# Altium project DAQ Board.PrjPcb
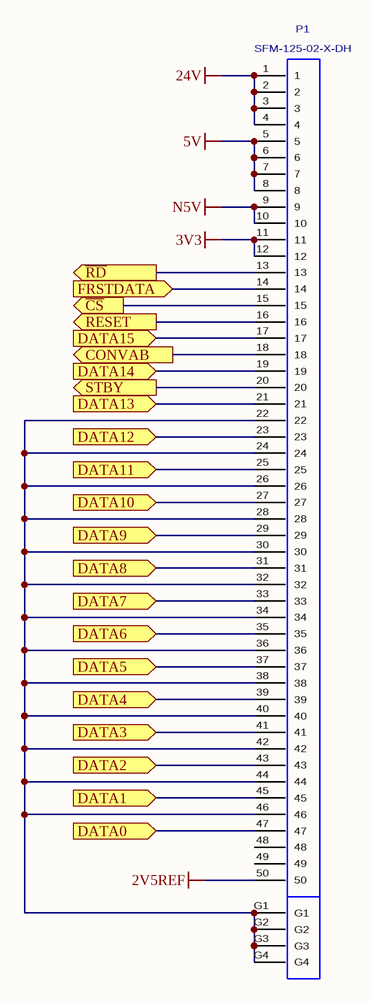
[diagram p0: DAQ Connector.SchDoc]
4 sheets, 86 parts. Net scope: flat (ports and power ports of the same name join across sheets).
Board file: DAQ_Board.PcbDoc
Sheets:
  DAQ Connector.SchDoc
  Charge Amp.SchDoc
  Analog to Digital Con.SchDoc
  Low Pass Filter.SchDoc

## Sheet DAQ Connector.SchDoc
size A

### Parts
P1  SFM-125-02-X-DH  [SFM-125-02-X-DH]

### Ports
CONVAB (out), DATA0 (in), DATA1 (in), DATA2 (in), DATA3 (in), DATA4 (in), DATA5 (in), DATA6 (in), DATA7 (in), DATA8 (in), DATA9 (in), DATA10 (in), DATA11 (in), DATA12 (in), DATA13 (in), DATA14 (in), DATA15 (in), FRSTDATA (in), RESET (out), STBY (out), ~{CS} (out), ~{RD} (out)

### Nets
2V5REF: P1.50
3V3: P1.11 P1.12
5V: P1.5 P1.6 P1.7 P1.8
24V: P1.1 P1.2 P1.3 P1.4
N5V: P1.9 P1.10
CONVAB: P1.18 ; port CONVAB
CS: P1.15 ; port ~{CS}
DATA0: P1.47 ; port DATA0
DATA1: P1.45 ; port DATA1
DATA2: P1.43 ; port DATA2
DATA3: P1.41 ; port DATA3
DATA4: P1.39 ; port DATA4
DATA5: P1.37 ; port DATA5
DATA6: P1.35 ; port DATA6
DATA7: P1.33 ; port DATA7
DATA8: P1.31 ; port DATA8
DATA9: P1.29 ; port DATA9
DATA10: P1.27 ; port DATA10
DATA11: P1.25 ; port DATA11
DATA12: P1.23 ; port DATA12
DATA13: P1.21 ; port DATA13
DATA14: P1.19 ; port DATA14
DATA15: P1.17 ; port DATA15
FRSTDATAA: P1.14 ; port FRSTDATA
RD: P1.13 ; port ~{RD}
RESET: P1.16 ; port RESET
STBY: P1.20 ; port STBY
NetP1_22: P1.22 P1.24 P1.26 P1.28 P1.30 P1.32 P1.34 P1.36 P1.38 P1.40 P1.42 P1.44 P1.46 P1.G1 P1.G2 P1.G3 P1.G4

Not connected (* = marked no-connect by the designer): P1 48 49

### Library data of the parts
P1 = SFM-125-02-X-DH: .050" (1,27mm) Tiger Eye Contact, Molded-to-Position Socket Strip, Double Horizontal.; MANUFACTURER: SAMTEC; CREATED: October 28, 2015 - Wendy Xin; PCB DECAL: SFM-125-02-X-DH

## Sheet Charge Amp.SchDoc
size A
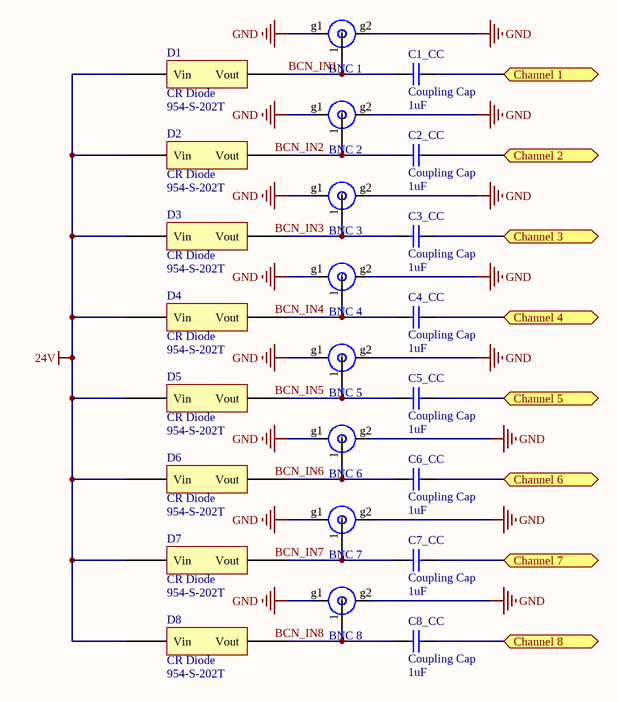
[diagram p1: Charge Amp.SchDoc]

### Parts
BNC_1  Component_1  [BNC 50OHM EDGE ACX2259]  (value not drawn)
BNC_2  Component_1  [BNC 50OHM EDGE ACX2259]  (value not drawn)
BNC_3  Component_1  [BNC 50OHM EDGE ACX2259]  (value not drawn)
BNC_4  Component_1  [BNC 50OHM EDGE ACX2259]  (value not drawn)
BNC_5  Component_1  [BNC 50OHM EDGE ACX2259]  (value not drawn)
BNC_6  Component_1  [BNC 50OHM EDGE ACX2259]  (value not drawn)
BNC_7  Component_1  [BNC 50OHM EDGE ACX2259]  (value not drawn)
BNC_8  Component_1  [BNC 50OHM EDGE ACX2259]  (value not drawn)
C1_CC  Coupling Cap  value 1uF  [6-0805_N]
C2_CC  Coupling Cap  value 1uF  [6-0805_N]
C3_CC  Coupling Cap  value 1uF  [6-0805_N]
C4_CC  Coupling Cap  value 1uF  [6-0805_N]
C5_CC  Coupling Cap  value 1uF  [6-0805_N]
C6_CC  Coupling Cap  value 1uF  [6-0805_N]
C7_CC  Coupling Cap  value 1uF  [6-0805_N]
C8_CC  Coupling Cap  value 1uF  [6-0805_N]
D1  CR Diode  Supplier Part Number 1: 954-S-202T  [CR Diode - duplicate1]
D2  CR Diode  Supplier Part Number 1: 954-S-202T  [CR Diode - duplicate1]
D3  CR Diode  Supplier Part Number 1: 954-S-202T  [CR Diode - duplicate1]
D4  CR Diode  Supplier Part Number 1: 954-S-202T  [CR Diode - duplicate1]
D5  CR Diode  Supplier Part Number 1: 954-S-202T  [CR Diode - duplicate1]
D6  CR Diode  Supplier Part Number 1: 954-S-202T  [CR Diode - duplicate1]
D7  CR Diode  Supplier Part Number 1: 954-S-202T  [CR Diode - duplicate1]
D8  CR Diode  Supplier Part Number 1: 954-S-202T  [CR Diode - duplicate1]

### Ports
Channel 1, Channel 2, Channel 3, Channel 4, Channel 5, Channel 6, Channel 7, Channel 8

### Nets
24V: D1.a(Vin) D2.a(Vin) D3.a(Vin) D4.a(Vin) D5.a(Vin) D6.a(Vin) D7.a(Vin) D8.a(Vin)
GND: BNC_1.g1 BNC_1.g2(0) BNC_2.g1 BNC_2.g2(0) BNC_3.g1 BNC_3.g2(0) BNC_4.g1 BNC_4.g2(0) BNC_5.g1 BNC_5.g2(0) BNC_6.g1 BNC_6.g2(0) BNC_7.g1 BNC_7.g2(0) BNC_8.g1 BNC_8.g2(0)
BCN_IN1: BNC_1.1(Signal) C1_CC.1 D1.k(Vout)
NetBNC_2_1: BNC_2.1(Signal) C2_CC.1 D2.k(Vout)
NetBNC_3_1: BNC_3.1(Signal) C3_CC.1 D3.k(Vout)
NetBNC_4_1: BNC_4.1(Signal) C4_CC.1 D4.k(Vout)
NetBNC_5_1: BNC_5.1(Signal) C5_CC.1 D5.k(Vout)
NetBNC_6_1: BNC_6.1(Signal) C6_CC.1 D6.k(Vout)
NetBNC_7_1: BNC_7.1(Signal) C7_CC.1 D7.k(Vout)
NetBNC_8_1: BNC_8.1(Signal) C8_CC.1 D8.k(Vout)
NetC1_CC_2: C1_CC.2 ; port Channel 1
NetC2_CC_2: C2_CC.2 ; port Channel 2
NetC3_CC_2: C3_CC.2 ; port Channel 3
NetC4_CC_2: C4_CC.2 ; port Channel 4
NetC5_CC_2: C5_CC.2 ; port Channel 5
NetC6_CC_2: C6_CC.2 ; port Channel 6
NetC7_CC_2: C7_CC.2 ; port Channel 7
NetC8_CC_2: C8_CC.2 ; port Channel 8

### Notes on the sheet
- Labels drawn without touching a wire or pin: BCN_IN2, BCN_IN3, BCN_IN4, BCN_IN5, BCN_IN6, BCN_IN7, BCN_IN8

### Library data of the parts
BNC_1-BNC_8 = Component_1: CONN BNC JACK 50 OHM EDGE MNT; Supplier 1: Digi-Key; Supplier Part Number 1: ACX2259-ND
C1_CC C2_CC C3_CC C4_CC C5_CC C6_CC C7_CC C8_CC = Cap Semi: Capacitor (Semiconductor SIM Model); Published: 8-Jun-2000; LatestRevisionDate: 29-May-2009; LatestRevisionNote: IPC-7351 Footprint Added.; PackageReference: C1206; Publisher: Altium Limited; PackageDescription: Chip Capacitor; Supplier 1: Digi-Key; Supplier Part Number 1: 1276-1066-1-ND
D1-D8 = Diode_1: Current Regulator Diodes 100V 2mA; Supplier 1: Mouser

## Sheet Analog to Digital Con.SchDoc
size A
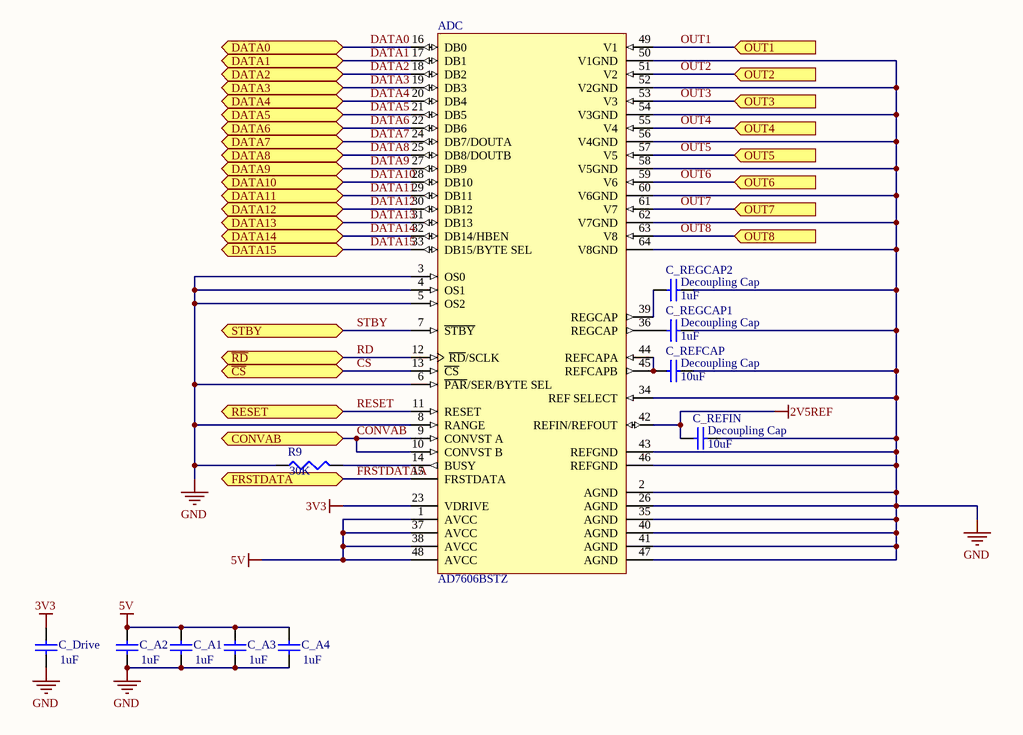
[diagram p2: Analog to Digital Con.SchDoc]

### Parts
ADC  AD7606BSTZ  [ST-64-2_N]
C_A1  value 1uF  [6-0805_N]  (hidden comment: Decoupling Cap)
C_A2  value 1uF  [6-0805_N]  (hidden comment: Decoupling Cap)
C_A3  value 1uF  [6-0805_N]  (hidden comment: Decoupling Cap)
C_A4  value 1uF  [6-0805_N]  (hidden comment: Decoupling Cap)
C_Drive  value 1uF  [6-0805_N]  (hidden comment: Decoupling Cap)
C_REFCAP  Decoupling Cap  value 10uF  [6-0805_N]
C_REFIN  Decoupling Cap  value 10uF  [6-0805_N]
C_REGCAP1  Decoupling Cap  value 1uF  [6-0805_N]
C_REGCAP2  Decoupling Cap  value 1uF  [6-0805_N]
R9  value 30K  [6-0805_N]  (hidden comment: Res3)

### Ports
CONVAB, DATA0, DATA1, DATA2, DATA3, DATA4, DATA5, DATA6, DATA7, DATA8, DATA9, DATA10, DATA11, DATA12, DATA13, DATA14, DATA15, FRSTDATA, OUT1 (in), OUT2 (in), OUT3 (in), OUT4 (in), OUT5 (in), OUT6 (in), OUT7 (in), OUT8 (in), RESET, STBY, ~{CS}, ~{RD}

### Nets
2V5REF: ADC.42(REFIN/REFOUT) C_REFIN.2
3V3: ADC.23(VDRIVE) C_Drive.1
5V: ADC.1(AVCC) ADC.37(AVCC) ADC.38(AVCC) ADC.48(AVCC) C_A1.1 C_A2.1 C_A3.1 C_A4.1
GND: ADC.2(AGND) ADC.3(OS0) ADC.4(OS1) ADC.5(OS2) ADC.6(~{PAR}/SER/BYTE_SEL) ADC.8(RANGE) ADC.26(AGND) ADC.34(REF_SELECT) ADC.35(AGND) ADC.40(AGND) ADC.41(AGND) ADC.43(REFGND) ADC.46(REFGND) ADC.47(AGND) ADC.50(V1GND) ADC.52(V2GND) ADC.54(V3GND) ADC.56(V4GND) ADC.58(V5GND) ADC.60(V6GND) ADC.62(V7GND) ADC.64(V8GND) C_A1.2 C_A2.2 C_A3.2 C_A4.2 C_Drive.2 C_REFCAP.1 C_REFIN.1 C_REGCAP1.1 C_REGCAP2.1 R9.1
CONVAB: ADC.9(CONVST_A) ADC.10(CONVST_B) ; port CONVAB
CS: ADC.13(~{CS}) ; port ~{CS}
DATA0: ADC.16(DB0) ; port DATA0
DATA1: ADC.17(DB1) ; port DATA1
DATA2: ADC.18(DB2) ; port DATA2
DATA3: ADC.19(DB3) ; port DATA3
DATA4: ADC.20(DB4) ; port DATA4
DATA5: ADC.21(DB5) ; port DATA5
DATA6: ADC.22(DB6) ; port DATA6
DATA7: ADC.24(DB7/DOUTA) ; port DATA7
DATA8: ADC.25(DB8/DOUTB) ; port DATA8
DATA9: ADC.27(DB9) ; port DATA9
DATA10: ADC.28(DB10) ; port DATA10
DATA11: ADC.29(DB11) ; port DATA11
DATA12: ADC.30(DB12) ; port DATA12
DATA13: ADC.31(DB13) ; port DATA13
DATA14: ADC.32(DB14/HBEN) ; port DATA14
DATA15: ADC.33(DB15/BYTE_SEL) ; port DATA15
FRSTDATAA: ADC.15(FRSTDATA) ; port FRSTDATA
OUT1: ADC.49(V1) ; port OUT1
OUT2: ADC.51(V2) ; port OUT2
OUT3: ADC.53(V3) ; port OUT3
OUT4: ADC.55(V4) ; port OUT4
OUT5: ADC.57(V5) ; port OUT5
OUT6: ADC.59(V6) ; port OUT6
OUT7: ADC.61(V7) ; port OUT7
OUT8: ADC.63(V8) ; port OUT8
RD: ADC.12(~{RD}/SCLK) ; port ~{RD}
RESET: ADC.11(RESET) ; port RESET
STBY: ADC.7(~{STBY}) ; port STBY
NetADC_14: ADC.14(BUSY) R9.2
NetADC_36: ADC.36(REGCAP) C_REGCAP1.2
NetADC_39: ADC.39(REGCAP) C_REGCAP2.2
NetADC_44: ADC.44(REFCAPA) ADC.45(REFCAPB) C_REFCAP.2

### Library data of the parts
ADC = AD7606BSTZ: 8 Channel Data Acquisition System with 16-Bit, Bipolar Input, Simultaneous Sampling Analog-to-Digital Converter with Parallel, Serial and SPI Interface, 200KSPS, -40 to +85 degC, ST-64-2, Pb-Free, Tray; Generic Part Number: AD7606; Manufacturer: Analog Devices; Resolution (Bits): 16; Channels: 8; Throughput Rate (SPS): 200K; Interface: Par, Ser, SPI; DatasheetVersion: Rev.C; PackageVersion: 051706-A; PackageReference: ST-64-2; PackageDescription: 64-Lead Low Profile Quad Flat Package [LQFP]; Supplier 1: Digi-Key; Supplier Part Number 1: AD7606BSTZ-ND; Supplier 2: Farnell; Supplier Part Number 2: 1864685; Supplier 3: Newark; Supplier Part Number 3: 76R7614; Supplier 4: Mouser; Supplier Part Number 4: 584-AD7606BSTZ; RoHS: Y; Packing: Tray; Mounting Technology: Surface Mount; Code_JEDEC: MS-026-BCD; PartNumber: AD7606BSTZ; ComponentLink1Description: Manufacturer URL; ComponentLink1URL: http://www.analog.com/en/index.html; ComponentLink2Description: Datasheet; ComponentLink2URL: http://www.analog.com/static/imported-files/data_sheets/AD7606_7606-6_7606-4.pdf; ComponentLink3Description: Package Specification; ComponentLink3URL: http://www.analog.com/static/imported-files/packages/PKG_PDF/LQFP%28ST%29/ST_64_2.pdf; ComponentLink4Description: Product URL; ComponentLink4URL: http://www.analog.com/en/analog-to-digital-converters/ad-converters/ad7606/products/product.html
C_A1-C_A4 C_Drive C_REFCAP C_REFIN C_REGCAP1 C_REGCAP2 = Cap Semi: Capacitor (Semiconductor SIM Model); Published: 8-Jun-2000; LatestRevisionDate: 29-May-2009; LatestRevisionNote: IPC-7351 Footprint Added.; PackageReference: C1206; Publisher: Altium Limited; PackageDescription: Chip Capacitor; Supplier 2: Digi-Key
  C_A1-C_A4 C_Drive C_REGCAP1 C_REGCAP2: Supplier Part Number 2: 1276-1066-1-ND
  C_REFCAP C_REFIN: Supplier Part Number 2: 490-3340-1-ND
R9 = Res3: Resistor; Published: 8-Jun-2000; LatestRevisionDate: 29-May-2009; LatestRevisionNote: IPC-7351 Footprint Added.; PackageReference: J1-0603; Publisher: Altium Limited; PackageDescription: Chip Resistor; Supplier 1: Digi-Key; Supplier Part Number 1: 311-30KARCT-ND

## Sheet Low Pass Filter.SchDoc
size A
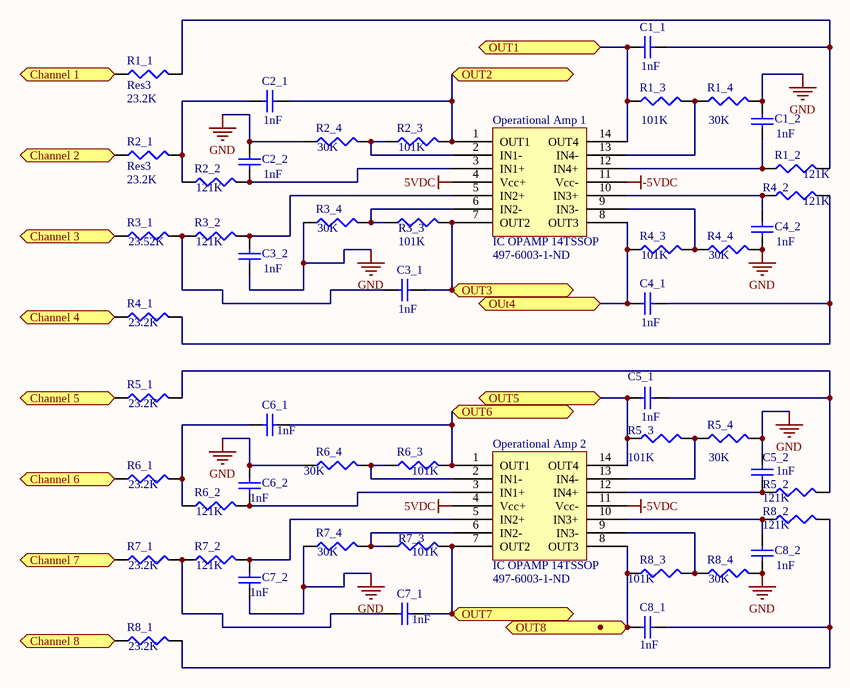
[diagram p3: Low Pass Filter.SchDoc]

### Parts
C1_1  value 1nF  [6-0805_N]  (hidden comment: Cap Semi)
C1_2  value 1nF  [6-0805_N]  (hidden comment: Cap Semi)
C2_1  value 1nF  [6-0805_N]  (hidden comment: Cap Semi)
C2_2  value 1nF  [6-0805_N]  (hidden comment: Cap Semi)
C3_1  value 1nF  [6-0805_N]  (hidden comment: Cap Semi)
C3_2  value 1nF  [6-0805_N]  (hidden comment: Cap Semi)
C4_1  value 1nF  [6-0805_N]  (hidden comment: Cap Semi)
C4_2  value 1nF  [6-0805_N]  (hidden comment: Cap Semi)
C5_1  value 1nF  [6-0805_N]  (hidden comment: Cap Semi)
C5_2  value 1nF  [6-0805_N]  (hidden comment: Cap Semi)
C6_1  value 1nF  [6-0805_N]  (hidden comment: Cap Semi)
C6_2  value 1nF  [6-0805_N]  (hidden comment: Cap Semi)
C7_1  value 1nF  [6-0805_N]  (hidden comment: Cap Semi)
C7_2  value 1nF  [6-0805_N]  (hidden comment: Cap Semi)
C8_1  value 1nF  [6-0805_N]  (hidden comment: Cap Semi)
C8_2  value 1nF  [6-0805_N]  (hidden comment: Cap Semi)
Operational_Amp_1  IC OPAMP 14TSSOP  Supplier Part Number 1: 497-6003-1-ND  [TSV994IPT]
Operational_Amp_2  IC OPAMP 14TSSOP  Supplier Part Number 1: 497-6003-1-ND  [TSV994IPT]
R1_1  Res3  value 23.2K  [6-0805_N]
R1_2  value 121K  [6-0805_N]  (hidden comment: Res3)
R1_3  value 101K  [6-0805_N]  (hidden comment: Res3)
R1_4  value 30K  [6-0805_N]  (hidden comment: Res3)
R2_1  Res3  value 23.2K  [6-0805_N]
R2_2  value 121K  [6-0805_N]  (hidden comment: Res3)
R2_3  value 101K  [6-0805_N]  (hidden comment: Res3)
R2_4  value 30K  [6-0805_N]  (hidden comment: Res3)
R3_1  value 23.52K  [6-0805_N]  (hidden comment: Res3)
R3_2  value 121K  [6-0805_N]  (hidden comment: Res3)
R3_3  value 101K  [6-0805_N]  (hidden comment: Res3)
R3_4  value 30K  [6-0805_N]  (hidden comment: Res3)
R4_1  value 23.2K  [6-0805_N]  (hidden comment: Res3)
R4_2  value 121K  [6-0805_N]  (hidden comment: Res3)
R4_3  value 101K  [6-0805_N]  (hidden comment: Res3)
R4_4  value 30K  [6-0805_N]  (hidden comment: Res3)
R5_1  value 23.2K  [6-0805_N]  (hidden comment: Res3)
R5_2  value 121K  [6-0805_N]  (hidden comment: Res3)
R5_3  value 101K  [6-0805_N]  (hidden comment: Res3)
R5_4  value 30K  [6-0805_N]  (hidden comment: Res3)
R6_1  value 23.2K  [6-0805_N]  (hidden comment: Res3)
R6_2  value 121K  [6-0805_N]  (hidden comment: Res3)
R6_3  value 101K  [6-0805_N]  (hidden comment: Res3)
R6_4  value 30K  [6-0805_N]  (hidden comment: Res3)
R7_1  value 23.2K  [6-0805_N]  (hidden comment: Res3)
R7_2  value 121K  [6-0805_N]  (hidden comment: Res3)
R7_3  value 101K  [6-0805_N]  (hidden comment: Res3)
R7_4  value 30K  [6-0805_N]  (hidden comment: Res3)
R8_1  value 23.2K  [6-0805_N]  (hidden comment: Res3)
R8_2  value 121K  [6-0805_N]  (hidden comment: Res3)
R8_3  value 101K  [6-0805_N]  (hidden comment: Res3)
R8_4  value 30K  [6-0805_N]  (hidden comment: Res3)

### Ports
Channel 1, Channel 2, Channel 3, Channel 4, Channel 5, Channel 6, Channel 7, Channel 8, OUT1, OUT2, OUT3, OUt4, OUT5, OUT6, OUT7, OUT8

### Nets
5VDC: Operational_Amp_1.4(Vcc+) Operational_Amp_2.4(Vcc+)
-5VDC: Operational_Amp_1.11(Vcc-) Operational_Amp_2.11(Vcc-)
GND: C1_2.1 C2_2.2 C3_2.1 C4_2.1 C5_2.2 C6_2.2 C7_2.1 C8_2.1 R1_4.2 R2_4.1 R3_4.1 R4_4.2 R5_4.2 R6_4.1 R7_4.1 R8_4.2
OUT1: C1_1.1 Operational_Amp_1.14(OUT4) R1_3.1 ; port OUT1
OUT2: C2_1.2 Operational_Amp_1.1(OUT1) R2_3.2 ; port OUT2
OUT3: C3_1.2 Operational_Amp_1.7(OUT2) R3_3.2 ; port OUT3
OUT4: C4_1.1 Operational_Amp_1.8(OUT3) R4_3.1 ; port OUt4
OUT5: C5_1.1 Operational_Amp_2.14(OUT4) R5_3.1 ; port OUT5
OUT6: C6_1.2 Operational_Amp_2.1(OUT1) R6_3.2 ; port OUT6
OUT7: C7_1.2 Operational_Amp_2.7(OUT2) R7_3.2 ; port OUT7
OUT8: C8_1.2 Operational_Amp_2.8(OUT3) R8_3.1 ; port OUT8
NetC1_1_2: C1_1.2 R1_1.2 R1_2.2
NetC1_2_2: C1_2.2 Operational_Amp_1.12(IN4+) R1_2.1
NetC1_CC_2: R1_1.1 ; port Channel 1
NetC2_1_1: C2_1.1 R2_1.2 R2_2.1
NetC2_2_1: C2_2.1 Operational_Amp_1.3(IN1+) R2_2.2
NetC2_CC_2: R2_1.1 ; port Channel 2
NetC3_1_1: C3_1.1 R3_1.2 R3_2.1
NetC3_2_2: C3_2.2 Operational_Amp_1.5(IN2+) R3_2.2
NetC3_CC_2: R3_1.1 ; port Channel 3
NetC4_1_2: C4_1.2 R4_1.2 R4_2.2
NetC4_2_2: C4_2.2 Operational_Amp_1.10(IN3+) R4_2.1
NetC4_CC_2: R4_1.1 ; port Channel 4
NetC5_1_2: C5_1.2 R5_1.2 R5_2.2
NetC5_2_1: C5_2.1 Operational_Amp_2.12(IN4+) R5_2.1
NetC5_CC_2: R5_1.1 ; port Channel 5
NetC6_1_1: C6_1.1 R6_1.2 R6_2.1
NetC6_2_1: C6_2.1 Operational_Amp_2.3(IN1+) R6_2.2
NetC6_CC_2: R6_1.1 ; port Channel 6
NetC7_1_1: C7_1.1 R7_1.2 R7_2.1
NetC7_2_2: C7_2.2 Operational_Amp_2.5(IN2+) R7_2.2
NetC7_CC_2: R7_1.1 ; port Channel 7
NetC8_1_1: C8_1.1 R8_1.2 R8_2.2
NetC8_2_2: C8_2.2 Operational_Amp_2.10(IN3+) R8_2.1
NetC8_CC_2: R8_1.1 ; port Channel 8
NetOperational_Amp_1_2: Operational_Amp_1.2(IN1-) R2_3.1 R2_4.2
NetOperational_Amp_1_6: Operational_Amp_1.6(IN2-) R3_3.1 R3_4.2
NetOperational_Amp_1_9: Operational_Amp_1.9(IN3-) R4_3.2 R4_4.1
NetOperational_Amp_1_13: Operational_Amp_1.13(IN4-) R1_3.2 R1_4.1
NetOperational_Amp_2_2: Operational_Amp_2.2(IN1-) R6_3.1 R6_4.2
NetOperational_Amp_2_6: Operational_Amp_2.6(IN2-) R7_3.1 R7_4.2
NetOperational_Amp_2_9: Operational_Amp_2.9(IN3-) R8_3.2 R8_4.1
NetOperational_Amp_2_13: Operational_Amp_2.13(IN4-) R5_3.2 R5_4.1

### Library data of the parts
C1_1 C1_2 C2_1 C2_2 C3_1 C3_2 C4_1 C4_2 C5_1 C5_2 C6_1 C6_2 C7_1 C7_2 C8_1 C8_2 = Cap Semi: Capacitor (Semiconductor SIM Model); Published: 8-Jun-2000; LatestRevisionDate: 29-May-2009; LatestRevisionNote: IPC-7351 Footprint Added.; PackageReference: C1206; Publisher: Altium Limited; PackageDescription: Chip Capacitor
  C1_1 C1_2 C2_1 C2_2 C3_1 C4_1 C4_2 C5_1 C5_2 C6_1 C6_2 C7_1 C7_2 C8_1 C8_2: Supplier 2: Digi-Key; Supplier Part Number 2: 1276-1066-1-ND
  C3_2: Supplier 1: Digi-Key; Supplier Part Number 1: 1276-1066-1-ND
Operational_Amp_1 Operational_Amp_2 = Component_1: Supplier 1: Digi-Key
R1_1-R1_4 R2_1-R2_4 R3_1-R3_4 R4_1-R4_4 R5_1-R5_4 R6_1-R6_4 R7_1-R7_4 R8_1-R8_4 = Res3: Resistor; Published: 8-Jun-2000; LatestRevisionDate: 29-May-2009; LatestRevisionNote: IPC-7351 Footprint Added.; PackageReference: J1-0603; Publisher: Altium Limited; PackageDescription: Chip Resistor
  R1_1 R2_1 R3_1 R4_1 R5_1 R6_1 R7_1 R8_1: Supplier 2: Digi-Key; Supplier Part Number 2: 311-23.2KCRCT-ND
  R1_2 R2_2 R3_2 R4_2 R5_2 R6_2 R7_2 R8_2: Supplier 1: Digi-Key; Supplier Part Number 1: 311-121KCRCT-ND
  R1_3 R4_3 R5_3 R6_3 R7_3: Supplier 2: Digi-Key; Supplier Part Number 2: RNCF0805BTC101K-ND
  R1_4 R2_4 R3_4 R4_4 R5_4 R6_4 R7_4 R8_4: Supplier 1: Digi-Key; Supplier Part Number 1: 311-30KARCT-ND
  R2_3 R3_3 R8_3: Supplier 1: Digi-Key; Supplier Part Number 1: RNCF0805BTC101K-ND

## Nets that join several sheets
2V5REF: DAQ Connector (P1.50), Analog to Digital Con (ADC.42 C_REFIN.2)
3V3: DAQ Connector (P1.11 P1.12), Analog to Digital Con (ADC.23 C_Drive.1)
5V: DAQ Connector (P1.5 P1.6 P1.7 P1.8), Analog to Digital Con (8 pins)
24V: DAQ Connector (P1.1 P1.2 P1.3 P1.4), Charge Amp (8 pins)
GND: Charge Amp (16 pins), Analog to Digital Con (32 pins), Low Pass Filter (16 pins)
CONVAB: DAQ Connector (P1.18), Analog to Digital Con (ADC.9 ADC.10)
CS: DAQ Connector (P1.15), Analog to Digital Con (ADC.13)
DATA0: DAQ Connector (P1.47), Analog to Digital Con (ADC.16)
DATA1: DAQ Connector (P1.45), Analog to Digital Con (ADC.17)
DATA2: DAQ Connector (P1.43), Analog to Digital Con (ADC.18)
DATA3: DAQ Connector (P1.41), Analog to Digital Con (ADC.19)
DATA4: DAQ Connector (P1.39), Analog to Digital Con (ADC.20)
DATA5: DAQ Connector (P1.37), Analog to Digital Con (ADC.21)
DATA6: DAQ Connector (P1.35), Analog to Digital Con (ADC.22)
DATA7: DAQ Connector (P1.33), Analog to Digital Con (ADC.24)
DATA8: DAQ Connector (P1.31), Analog to Digital Con (ADC.25)
DATA9: DAQ Connector (P1.29), Analog to Digital Con (ADC.27)
DATA10: DAQ Connector (P1.27), Analog to Digital Con (ADC.28)
DATA11: DAQ Connector (P1.25), Analog to Digital Con (ADC.29)
DATA12: DAQ Connector (P1.23), Analog to Digital Con (ADC.30)
DATA13: DAQ Connector (P1.21), Analog to Digital Con (ADC.31)
DATA14: DAQ Connector (P1.19), Analog to Digital Con (ADC.32)
DATA15: DAQ Connector (P1.17), Analog to Digital Con (ADC.33)
FRSTDATAA: DAQ Connector (P1.14), Analog to Digital Con (ADC.15)
NetC1_CC_2: Charge Amp (C1_CC.2), Low Pass Filter (R1_1.1)
NetC2_CC_2: Charge Amp (C2_CC.2), Low Pass Filter (R2_1.1)
NetC3_CC_2: Charge Amp (C3_CC.2), Low Pass Filter (R3_1.1)
NetC4_CC_2: Charge Amp (C4_CC.2), Low Pass Filter (R4_1.1)
NetC5_CC_2: Charge Amp (C5_CC.2), Low Pass Filter (R5_1.1)
NetC6_CC_2: Charge Amp (C6_CC.2), Low Pass Filter (R6_1.1)
NetC7_CC_2: Charge Amp (C7_CC.2), Low Pass Filter (R7_1.1)
NetC8_CC_2: Charge Amp (C8_CC.2), Low Pass Filter (R8_1.1)
OUT1: Analog to Digital Con (ADC.49), Low Pass Filter (C1_1.1 Operational_Amp_1.14 R1_3.1)
OUT2: Analog to Digital Con (ADC.51), Low Pass Filter (C2_1.2 Operational_Amp_1.1 R2_3.2)
OUT3: Analog to Digital Con (ADC.53), Low Pass Filter (C3_1.2 Operational_Amp_1.7 R3_3.2)
OUT4: Analog to Digital Con (ADC.55), Low Pass Filter (C4_1.1 Operational_Amp_1.8 R4_3.1)
OUT5: Analog to Digital Con (ADC.57), Low Pass Filter (C5_1.1 Operational_Amp_2.14 R5_3.1)
OUT6: Analog to Digital Con (ADC.59), Low Pass Filter (C6_1.2 Operational_Amp_2.1 R6_3.2)
OUT7: Analog to Digital Con (ADC.61), Low Pass Filter (C7_1.2 Operational_Amp_2.7 R7_3.2)
OUT8: Analog to Digital Con (ADC.63), Low Pass Filter (C8_1.2 Operational_Amp_2.8 R8_3.1)
RD: DAQ Connector (P1.13), Analog to Digital Con (ADC.12)
RESET: DAQ Connector (P1.16), Analog to Digital Con (ADC.11)
STBY: DAQ Connector (P1.20), Analog to Digital Con (ADC.7)